# Altium schematic sheet Temperature.SchDoc
size A
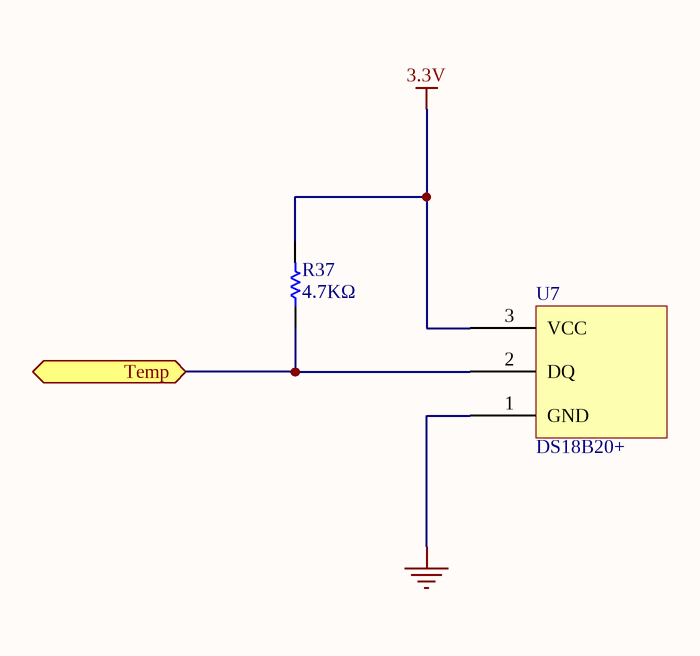
[diagram p0: Temperature.SchDoc]

## Parts
R37  4.7KΩ  [R0603]
U7  DS18B20+  [DS18B20+]

## Ports
Temp (bidir)

## Nets
3.3V: R37.2 U7.3(VCC)
GND: U7.1(GND)
Temp: R37.1 U7.2(DQ) ; port Temp

## Library data of the parts
R37 = Res1: Resistor; Manufacturer: MULTICOMP; Ref.Manufacturer: MC0063W060314K7; Value: 1K; Published: 8-Jun-2000; LatestRevisionDate: 17-Jul-2002; LatestRevisionNote: Re-released for DXP Platform.; PackageReference: AXIAL-0.3; Publisher: Altium Limited; PackageDescription: Axial Device, Thru-Hole; 2 Leads; 0.3 in Pin Spacing; Ref.Farnell: 9331247; Supplier: Farnell
U7 = DS18B20+: Temp; Manufacturer: MAXIM INTEGRATED PRODUCTS; Ref.Farnell: 2515553; Ref.Manufacturer: DS18B20+; Supplier: Farnell